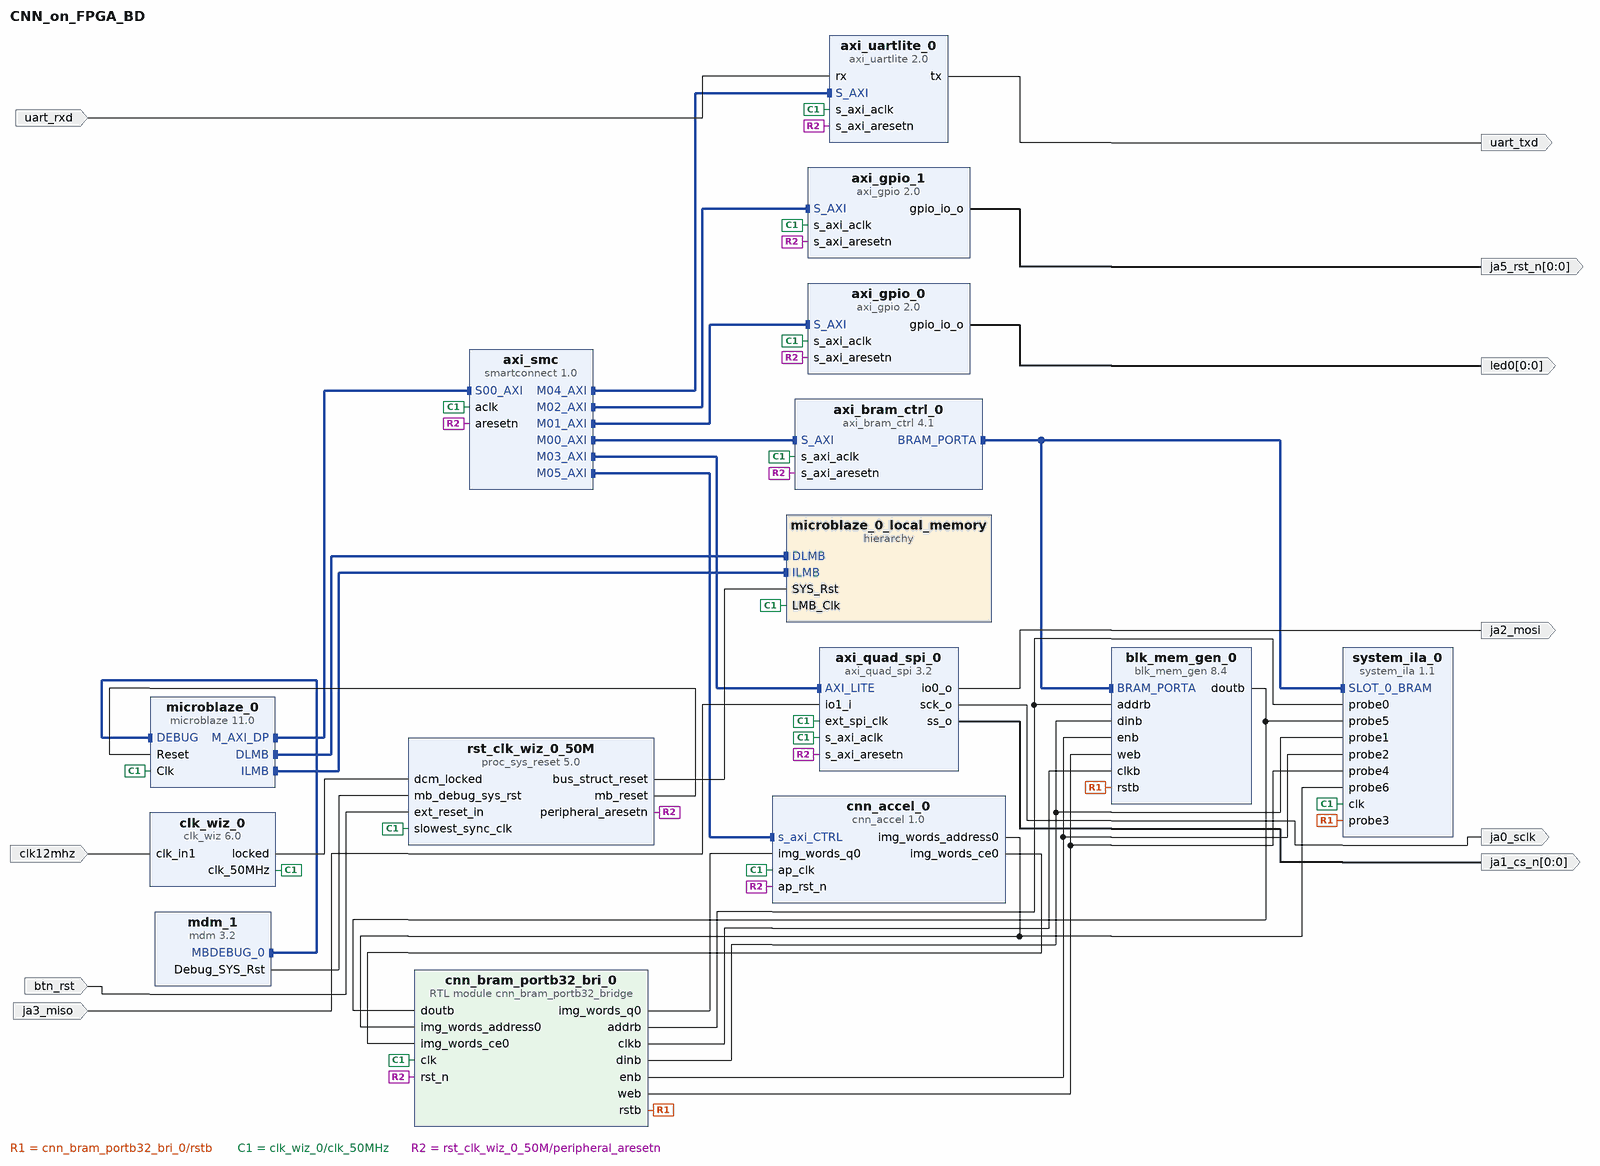
[diagram p0: block diagram of the top level]
# Vivado block design CNN_on_FPGA_BD, xc7a35tcpg236-1, Vivado 2024.1
create_bd_design CNN_on_FPGA_BD

create_bd_port -dir I -type rst btn_rst
set_property -dict {CONFIG.POLARITY ACTIVE_HIGH} [get_bd_ports btn_rst]
create_bd_port -dir I -type clk clk12mhz
set_property -dict {CONFIG.FREQ_HZ 12000000} [get_bd_ports clk12mhz]
create_bd_port -dir O ja0_sclk
create_bd_port -dir O -from 0 -to 0 ja1_cs_n
create_bd_port -dir O ja2_mosi
create_bd_port -dir I ja3_miso
create_bd_port -dir O -from 0 -to 0 ja5_rst_n
create_bd_port -dir O -from 0 -to 0 led0
create_bd_port -dir I uart_rxd
create_bd_port -dir O uart_txd

create_bd_cell -type ip -vlnv xilinx.com:ip:axi_bram_ctrl:4.1 axi_bram_ctrl_0
set_property -dict {CONFIG.SINGLE_PORT_BRAM 1} [get_bd_cells axi_bram_ctrl_0]
create_bd_cell -type ip -vlnv xilinx.com:ip:axi_gpio:2.0 axi_gpio_0
set_property -dict {CONFIG.C_ALL_OUTPUTS 1 CONFIG.C_GPIO_WIDTH 1} [get_bd_cells axi_gpio_0]
create_bd_cell -type ip -vlnv xilinx.com:ip:axi_gpio:2.0 axi_gpio_1
set_property -dict {CONFIG.C_ALL_OUTPUTS 1 CONFIG.C_DOUT_DEFAULT 0x00000001 CONFIG.C_GPIO_WIDTH 1} [get_bd_cells axi_gpio_1]
create_bd_cell -type ip -vlnv xilinx.com:ip:axi_quad_spi:3.2 axi_quad_spi_0
set_property -dict {CONFIG.C_USE_STARTUP 0} [get_bd_cells axi_quad_spi_0]
create_bd_cell -type ip -vlnv xilinx.com:ip:smartconnect:1.0 axi_smc
set_property -dict {CONFIG.NUM_MI 6 CONFIG.NUM_SI 1} [get_bd_cells axi_smc]
create_bd_cell -type ip -vlnv xilinx.com:ip:axi_uartlite:2.0 axi_uartlite_0
set_property -dict [list \
  CONFIG.C_BAUDRATE 115200 \
  CONFIG.UARTLITE_BOARD_INTERFACE Custom \
  CONFIG.USE_BOARD_FLOW true \
] [get_bd_cells axi_uartlite_0]
create_bd_cell -type ip -vlnv xilinx.com:ip:blk_mem_gen:8.4 blk_mem_gen_0
set_property -dict [list \
  CONFIG.Assume_Synchronous_Clk false \
  CONFIG.Memory_Type True_Dual_Port_RAM \
  CONFIG.Operating_Mode_B WRITE_FIRST \
  CONFIG.Register_PortA_Output_of_Memory_Primitives false \
  CONFIG.Register_PortB_Output_of_Memory_Primitives false \
  CONFIG.Use_RSTA_Pin true \
  CONFIG.Use_RSTB_Pin true \
  CONFIG.Write_Width_A 32 \
  CONFIG.Write_Width_B 32 \
  CONFIG.use_bram_block BRAM_Controller \
] [get_bd_cells blk_mem_gen_0]
create_bd_cell -type ip -vlnv xilinx.com:ip:clk_wiz:6.0 clk_wiz_0
set_property -dict [list \
  CONFIG.CLKIN1_JITTER_PS 833.33 \
  CONFIG.CLKOUT1_JITTER 522.315 \
  CONFIG.CLKOUT1_PHASE_ERROR 668.310 \
  CONFIG.CLKOUT1_REQUESTED_OUT_FREQ 50.000 \
  CONFIG.CLK_OUT1_PORT clk_50MHz \
  CONFIG.MMCM_CLKFBOUT_MULT_F 62.500 \
  CONFIG.MMCM_CLKIN1_PERIOD 83.333 \
  CONFIG.MMCM_CLKIN2_PERIOD 10.0 \
  CONFIG.MMCM_CLKOUT0_DIVIDE_F 15.000 \
  CONFIG.PRIM_IN_FREQ 12.000 \
  CONFIG.USE_RESET false \
] [get_bd_cells clk_wiz_0]
create_bd_cell -type ip -vlnv xilinx.com:hls:cnn_accel:1.0 cnn_accel_0
create_bd_cell -type module -reference cnn_bram_portb32_bridge cnn_bram_portb32_bri_0
create_bd_cell -type ip -vlnv xilinx.com:ip:mdm:3.2 mdm_1
create_bd_cell -type ip -vlnv xilinx.com:ip:microblaze:11.0 microblaze_0
set_property -dict [list \
  CONFIG.C_DEBUG_ENABLED 1 \
  CONFIG.C_D_AXI 1 \
  CONFIG.C_D_LMB 1 \
  CONFIG.C_ENABLE_CONVERSION 0 \
  CONFIG.C_I_LMB 1 \
] [get_bd_cells microblaze_0]
create_bd_cell -type hier microblaze_0_local_memory
create_bd_cell -type ip -vlnv xilinx.com:ip:proc_sys_reset:5.0 rst_clk_wiz_0_50M
set_property -dict {CONFIG.RESET_BOARD_INTERFACE reset CONFIG.USE_BOARD_FLOW true} [get_bd_cells rst_clk_wiz_0_50M]
create_bd_cell -type ip -vlnv xilinx.com:ip:system_ila:1.1 system_ila_0
set_property -dict [list \
  CONFIG.C_MON_TYPE MIX \
  CONFIG.C_NUM_MONITOR_SLOTS 1 \
  CONFIG.C_NUM_OF_PROBES 7 \
  CONFIG.C_PROBE0_TYPE 0 \
  CONFIG.C_PROBE1_TYPE 0 \
  CONFIG.C_PROBE2_TYPE 0 \
  CONFIG.C_PROBE3_TYPE 0 \
  CONFIG.C_PROBE4_TYPE 0 \
  CONFIG.C_PROBE5_TYPE 0 \
  CONFIG.C_PROBE6_TYPE 0 \
  CONFIG.C_PROBE7_TYPE 0 \
  CONFIG.C_SLOT_0_INTF_TYPE xilinx.com:interface:bram_rtl:1.0 \
  CONFIG.C_SLOT_0_TYPE 0 \
] [get_bd_cells system_ila_0]

# ---- hierarchy /microblaze_0_local_memory ----
current_bd_instance /microblaze_0_local_memory
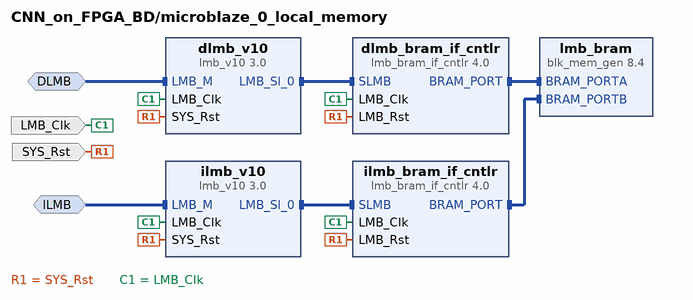
[diagram p1: block diagram inside /microblaze_0_local_memory]
create_bd_intf_pin -mode MirroredMaster -vlnv xilinx.com:interface:lmb_rtl:1.0 DLMB
create_bd_intf_pin -mode MirroredMaster -vlnv xilinx.com:interface:lmb_rtl:1.0 ILMB
create_bd_pin -dir I -type clk LMB_Clk
create_bd_pin -dir I -type rst SYS_Rst

create_bd_cell -type ip -vlnv xilinx.com:ip:lmb_v10:3.0 dlmb_v10
create_bd_cell -type ip -vlnv xilinx.com:ip:lmb_v10:3.0 ilmb_v10
create_bd_cell -type ip -vlnv xilinx.com:ip:lmb_bram_if_cntlr:4.0 dlmb_bram_if_cntlr
set_property -dict {CONFIG.C_ECC 0} [get_bd_cells dlmb_bram_if_cntlr]
create_bd_cell -type ip -vlnv xilinx.com:ip:lmb_bram_if_cntlr:4.0 ilmb_bram_if_cntlr
set_property -dict {CONFIG.C_ECC 0} [get_bd_cells ilmb_bram_if_cntlr]
create_bd_cell -type ip -vlnv xilinx.com:ip:blk_mem_gen:8.4 lmb_bram
set_property -dict {CONFIG.Memory_Type True_Dual_Port_RAM CONFIG.use_bram_block BRAM_Controller} [get_bd_cells lmb_bram]

# ---- connections ----

current_bd_instance /microblaze_0_local_memory
connect_bd_intf_net -intf_net microblaze_0_dlmb [get_bd_intf_pins dlmb_v10/LMB_M] [get_bd_intf_pins DLMB]
connect_bd_intf_net -intf_net microblaze_0_dlmb_bus [get_bd_intf_pins dlmb_v10/LMB_Sl_0] [get_bd_intf_pins dlmb_bram_if_cntlr/SLMB]
connect_bd_intf_net -intf_net microblaze_0_dlmb_cntlr [get_bd_intf_pins dlmb_bram_if_cntlr/BRAM_PORT] [get_bd_intf_pins lmb_bram/BRAM_PORTA]
connect_bd_intf_net -intf_net microblaze_0_ilmb [get_bd_intf_pins ilmb_v10/LMB_M] [get_bd_intf_pins ILMB]
connect_bd_intf_net -intf_net microblaze_0_ilmb_bus [get_bd_intf_pins ilmb_v10/LMB_Sl_0] [get_bd_intf_pins ilmb_bram_if_cntlr/SLMB]
connect_bd_intf_net -intf_net microblaze_0_ilmb_cntlr [get_bd_intf_pins ilmb_bram_if_cntlr/BRAM_PORT] [get_bd_intf_pins lmb_bram/BRAM_PORTB]
connect_bd_net [get_bd_pins SYS_Rst] \
  [get_bd_pins dlmb_v10/SYS_Rst] [get_bd_pins dlmb_bram_if_cntlr/LMB_Rst] [get_bd_pins ilmb_v10/SYS_Rst] \
  [get_bd_pins ilmb_bram_if_cntlr/LMB_Rst]
connect_bd_net -net microblaze_0_Clk [get_bd_pins LMB_Clk] \
  [get_bd_pins dlmb_v10/LMB_Clk] [get_bd_pins dlmb_bram_if_cntlr/LMB_Clk] [get_bd_pins ilmb_v10/LMB_Clk] \
  [get_bd_pins ilmb_bram_if_cntlr/LMB_Clk]
set_property HDL_ATTRIBUTE.BMM_INFO_ADDRESS_SPACE {byte  0x00000000 32 > CNN_on_FPGA_BD microblaze_0_local_memory/lmb_bram} [get_bd_cells dlmb_bram_if_cntlr]
set_property HDL_ATTRIBUTE.KEEP_HIERARCHY yes [get_bd_cells dlmb_bram_if_cntlr]

current_bd_instance /
connect_bd_intf_net -intf_net axi_bram_ctrl_0_BRAM_PORTA [get_bd_intf_pins blk_mem_gen_0/BRAM_PORTA] [get_bd_intf_pins axi_bram_ctrl_0/BRAM_PORTA]
connect_bd_intf_net [get_bd_intf_pins blk_mem_gen_0/BRAM_PORTA] [get_bd_intf_pins system_ila_0/SLOT_0_BRAM]
connect_bd_intf_net [get_bd_intf_pins axi_smc/M00_AXI] [get_bd_intf_pins axi_bram_ctrl_0/S_AXI]
connect_bd_intf_net [get_bd_intf_pins axi_smc/M01_AXI] [get_bd_intf_pins axi_gpio_0/S_AXI]
connect_bd_intf_net [get_bd_intf_pins axi_smc/M02_AXI] [get_bd_intf_pins axi_gpio_1/S_AXI]
connect_bd_intf_net [get_bd_intf_pins axi_smc/M03_AXI] [get_bd_intf_pins axi_quad_spi_0/AXI_LITE]
connect_bd_intf_net [get_bd_intf_pins axi_smc/M04_AXI] [get_bd_intf_pins axi_uartlite_0/S_AXI]
connect_bd_intf_net [get_bd_intf_pins microblaze_0/M_AXI_DP] [get_bd_intf_pins axi_smc/S00_AXI]
connect_bd_intf_net [get_bd_intf_pins axi_smc/M05_AXI] [get_bd_intf_pins cnn_accel_0/s_axi_CTRL]
connect_bd_intf_net [get_bd_intf_pins mdm_1/MBDEBUG_0] [get_bd_intf_pins microblaze_0/DEBUG]
connect_bd_intf_net [get_bd_intf_pins microblaze_0/DLMB] [get_bd_intf_pins microblaze_0_local_memory/DLMB]
connect_bd_intf_net [get_bd_intf_pins microblaze_0/ILMB] [get_bd_intf_pins microblaze_0_local_memory/ILMB]
connect_bd_net [get_bd_pins axi_gpio_0/gpio_io_o] [get_bd_ports led0]
connect_bd_net [get_bd_pins axi_gpio_1/gpio_io_o] [get_bd_ports ja5_rst_n]
connect_bd_net [get_bd_pins axi_quad_spi_0/io0_o] [get_bd_ports ja2_mosi]
connect_bd_net [get_bd_pins axi_quad_spi_0/sck_o] [get_bd_ports ja0_sclk]
connect_bd_net [get_bd_pins axi_quad_spi_0/ss_o] [get_bd_ports ja1_cs_n]
connect_bd_net [get_bd_pins axi_uartlite_0/tx] [get_bd_ports uart_txd]
connect_bd_net -net blk_mem_gen_0_doutb [get_bd_pins blk_mem_gen_0/doutb] [get_bd_pins cnn_bram_portb32_bri_0/doutb] [get_bd_pins system_ila_0/probe5]
connect_bd_net [get_bd_ports clk12mhz] [get_bd_pins clk_wiz_0/clk_in1]
connect_bd_net [get_bd_pins clk_wiz_0/locked] [get_bd_pins rst_clk_wiz_0_50M/dcm_locked]
connect_bd_net -net cnn_accel_0_img_words_address0 [get_bd_pins cnn_accel_0/img_words_address0] \
  [get_bd_pins cnn_bram_portb32_bri_0/img_words_address0] [get_bd_pins system_ila_0/probe6]
connect_bd_net [get_bd_pins cnn_accel_0/img_words_ce0] [get_bd_pins cnn_bram_portb32_bri_0/img_words_ce0]
connect_bd_net -net cnn_bram_portb32_bri_0_addrb [get_bd_pins cnn_bram_portb32_bri_0/addrb] \
  [get_bd_pins blk_mem_gen_0/addrb] [get_bd_pins system_ila_0/probe0]
connect_bd_net [get_bd_pins cnn_bram_portb32_bri_0/clkb] [get_bd_pins blk_mem_gen_0/clkb]
connect_bd_net -net cnn_bram_portb32_bri_0_dinb [get_bd_pins cnn_bram_portb32_bri_0/dinb] \
  [get_bd_pins blk_mem_gen_0/dinb] [get_bd_pins system_ila_0/probe1]
connect_bd_net -net cnn_bram_portb32_bri_0_enb [get_bd_pins cnn_bram_portb32_bri_0/enb] \
  [get_bd_pins blk_mem_gen_0/enb] [get_bd_pins system_ila_0/probe2]
connect_bd_net [get_bd_pins cnn_bram_portb32_bri_0/img_words_q0] [get_bd_pins cnn_accel_0/img_words_q0]
connect_bd_net -net cnn_bram_portb32_bri_0_rstb [get_bd_pins cnn_bram_portb32_bri_0/rstb] \
  [get_bd_pins blk_mem_gen_0/rstb] [get_bd_pins system_ila_0/probe3]
connect_bd_net -net cnn_bram_portb32_bri_0_web [get_bd_pins cnn_bram_portb32_bri_0/web] \
  [get_bd_pins blk_mem_gen_0/web] [get_bd_pins system_ila_0/probe4]
connect_bd_net [get_bd_ports ja3_miso] [get_bd_pins axi_quad_spi_0/io1_i]
connect_bd_net [get_bd_pins mdm_1/Debug_SYS_Rst] [get_bd_pins rst_clk_wiz_0_50M/mb_debug_sys_rst]
connect_bd_net -net microblaze_0_Clk [get_bd_pins clk_wiz_0/clk_50MHz] \
  [get_bd_pins microblaze_0/Clk] [get_bd_pins rst_clk_wiz_0_50M/slowest_sync_clk] [get_bd_pins axi_uartlite_0/s_axi_aclk] \
  [get_bd_pins axi_quad_spi_0/s_axi_aclk] [get_bd_pins axi_quad_spi_0/ext_spi_clk] [get_bd_pins axi_gpio_0/s_axi_aclk] \
  [get_bd_pins axi_gpio_1/s_axi_aclk] [get_bd_pins axi_bram_ctrl_0/s_axi_aclk] [get_bd_pins axi_smc/aclk] \
  [get_bd_pins cnn_bram_portb32_bri_0/clk] [get_bd_pins microblaze_0_local_memory/LMB_Clk] [get_bd_pins system_ila_0/clk] \
  [get_bd_pins cnn_accel_0/ap_clk]
connect_bd_net -net reset_1 [get_bd_ports btn_rst] [get_bd_pins rst_clk_wiz_0_50M/ext_reset_in]
connect_bd_net [get_bd_pins rst_clk_wiz_0_50M/bus_struct_reset] [get_bd_pins microblaze_0_local_memory/SYS_Rst]
connect_bd_net [get_bd_pins rst_clk_wiz_0_50M/mb_reset] [get_bd_pins microblaze_0/Reset]
connect_bd_net [get_bd_pins rst_clk_wiz_0_50M/peripheral_aresetn] \
  [get_bd_pins axi_uartlite_0/s_axi_aresetn] [get_bd_pins axi_quad_spi_0/s_axi_aresetn] \
  [get_bd_pins axi_gpio_0/s_axi_aresetn] [get_bd_pins axi_gpio_1/s_axi_aresetn] [get_bd_pins axi_bram_ctrl_0/s_axi_aresetn] \
  [get_bd_pins axi_smc/aresetn] [get_bd_pins cnn_bram_portb32_bri_0/rst_n] [get_bd_pins cnn_accel_0/ap_rst_n]
connect_bd_net -net rx_0_1 [get_bd_ports uart_rxd] [get_bd_pins axi_uartlite_0/rx]
set_property HDL_ATTRIBUTE.BMM_INFO_ADDRESS_SPACE {byte  0xC0000000 32 > CNN_on_FPGA_BD blk_mem_gen_0} [get_bd_cells axi_bram_ctrl_0]
set_property HDL_ATTRIBUTE.KEEP_HIERARCHY yes [get_bd_cells axi_bram_ctrl_0]
set_property HDL_ATTRIBUTE.BMM_INFO_PROCESSOR {microblaze-le > CNN_on_FPGA_BD microblaze_0_local_memory/dlmb_bram_if_cntlr CNN_on_FPGA_BD axi_bram_ctrl_0} [get_bd_cells microblaze_0]
set_property HDL_ATTRIBUTE.KEEP_HIERARCHY yes [get_bd_cells microblaze_0]
set_property HDL_ATTRIBUTE.DEBUG true [get_bd_intf_nets axi_bram_ctrl_0_BRAM_PORTA]
set_property HDL_ATTRIBUTE.MARK_DEBUG true [get_bd_intf_nets axi_bram_ctrl_0_BRAM_PORTA]
set_property HDL_ATTRIBUTE.DEBUG true [get_bd_nets blk_mem_gen_0_doutb]
set_property HDL_ATTRIBUTE.MARK_DEBUG true [get_bd_nets blk_mem_gen_0_doutb]
set_property HDL_ATTRIBUTE.DEBUG true [get_bd_nets cnn_accel_0_img_words_address0]
set_property HDL_ATTRIBUTE.MARK_DEBUG true [get_bd_nets cnn_accel_0_img_words_address0]
set_property HDL_ATTRIBUTE.DEBUG true [get_bd_nets cnn_bram_portb32_bri_0_addrb]
set_property HDL_ATTRIBUTE.MARK_DEBUG true [get_bd_nets cnn_bram_portb32_bri_0_addrb]
set_property HDL_ATTRIBUTE.DEBUG true [get_bd_nets cnn_bram_portb32_bri_0_dinb]
set_property HDL_ATTRIBUTE.MARK_DEBUG true [get_bd_nets cnn_bram_portb32_bri_0_dinb]
set_property HDL_ATTRIBUTE.DEBUG true [get_bd_nets cnn_bram_portb32_bri_0_enb]
set_property HDL_ATTRIBUTE.MARK_DEBUG true [get_bd_nets cnn_bram_portb32_bri_0_enb]
set_property HDL_ATTRIBUTE.DEBUG true [get_bd_nets cnn_bram_portb32_bri_0_rstb]
set_property HDL_ATTRIBUTE.MARK_DEBUG true [get_bd_nets cnn_bram_portb32_bri_0_rstb]
set_property HDL_ATTRIBUTE.DEBUG true [get_bd_nets cnn_bram_portb32_bri_0_web]
set_property HDL_ATTRIBUTE.MARK_DEBUG true [get_bd_nets cnn_bram_portb32_bri_0_web]

# ---- address map ----
assign_bd_address -offset 0x00000000 -range 16K -target_address_space [get_bd_addr_spaces microblaze_0/Data] [get_bd_addr_segs microblaze_0_local_memory/dlmb_bram_if_cntlr/SLMB/Mem]
assign_bd_address -offset 0x00010000 -range 64K -target_address_space [get_bd_addr_spaces microblaze_0/Data] [get_bd_addr_segs cnn_accel_0/s_axi_CTRL/Reg]
assign_bd_address -offset 0x00020000 -range 64K -target_address_space [get_bd_addr_spaces microblaze_0/Data] [get_bd_addr_segs axi_gpio_0/S_AXI/Reg]
assign_bd_address -offset 0x00030000 -range 64K -target_address_space [get_bd_addr_spaces microblaze_0/Data] [get_bd_addr_segs axi_gpio_1/S_AXI/Reg]
assign_bd_address -offset 0x04060000 -range 64K -target_address_space [get_bd_addr_spaces microblaze_0/Data] [get_bd_addr_segs axi_uartlite_0/S_AXI/Reg]
assign_bd_address -offset 0x44A00000 -range 64K -target_address_space [get_bd_addr_spaces microblaze_0/Data] [get_bd_addr_segs axi_quad_spi_0/AXI_LITE/Reg]
assign_bd_address -offset 0xC0000000 -range 8K -target_address_space [get_bd_addr_spaces microblaze_0/Data] [get_bd_addr_segs axi_bram_ctrl_0/S_AXI/Mem0]
assign_bd_address -offset 0x00000000 -range 16K -target_address_space [get_bd_addr_spaces microblaze_0/Instruction] [get_bd_addr_segs microblaze_0_local_memory/ilmb_bram_if_cntlr/SLMB/Mem]

validate_bd_design
save_bd_design
